# EAGLE schematic EEZ CF-DIC r5B7 (EAGLE 7.2.0)
Assembly variants: Farnell, TME

## Sheet 1 of 3: AC input, Bias supply
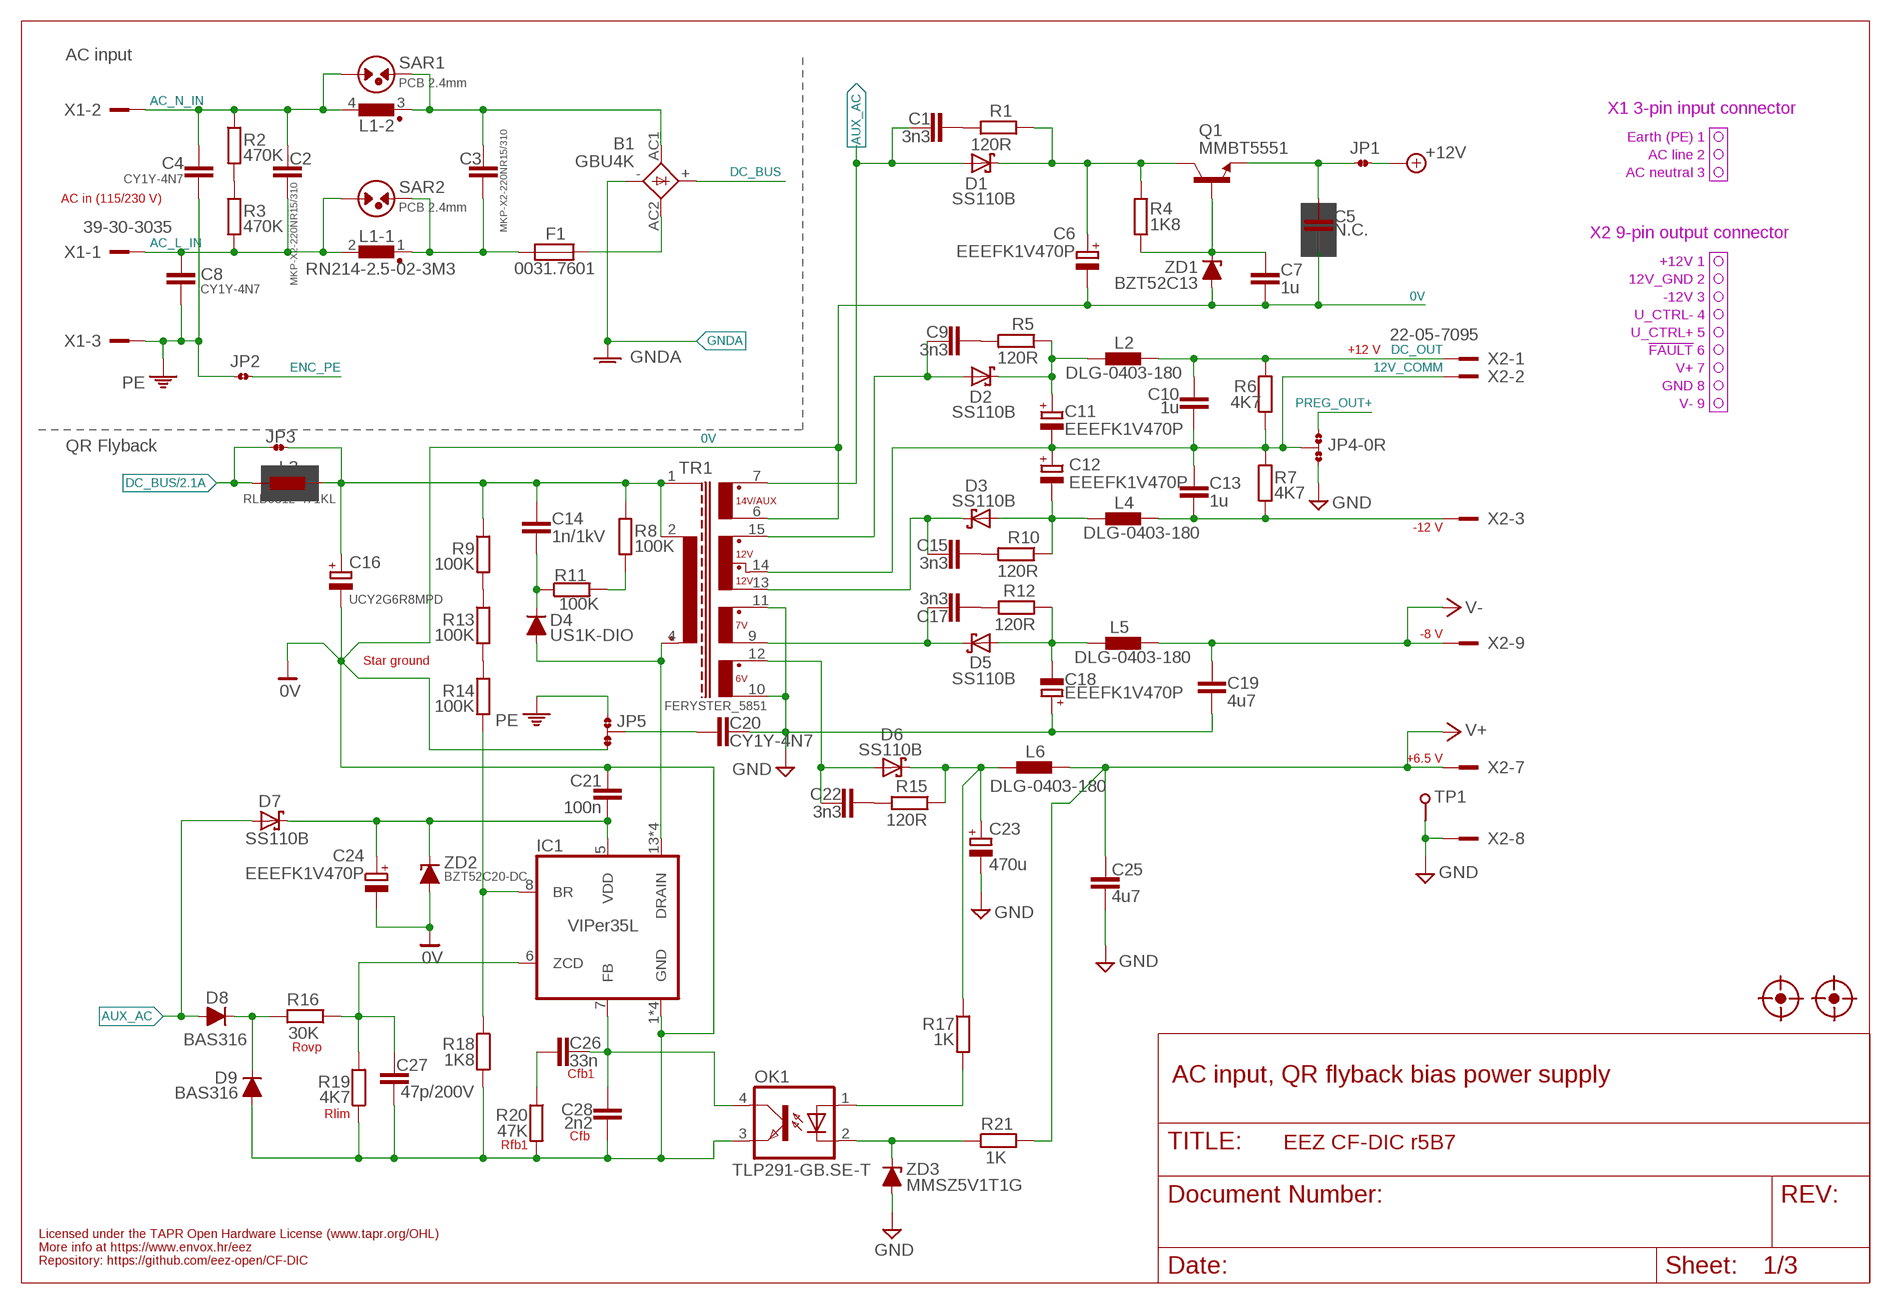
[diagram p0: schematic, sheet 1]

### Parts
B1  GBU4K  BRIDGE-CREEPAGE  [GBU4K_CRE]
C1  3n3  C-EUC0805  [C0805]
C2  MKP-X2-220NR15/310  C-EU150-072X183  [C150-072X183]
C3  MKP-X2-220NR15/310  C-EU150-072X183  [C150-072X183]
C4  CY1Y-4N7  C-EUCY  [CY075-032X103]
C5  N.C.  C-EUC0603  [C0603]
C6  EEEFK1V470P  ECAPPANASONIC_H  [CAPAE660X610N]
C7  1u  C-EUC0805  [C0805]
C8  CY1Y-4N7  C-EUCY  [CY075-032X103]
C9  3n3  C-EUC0805  [C0805]
C10  1u  C-EUC0805  [C0805]
C11  EEEFK1V470P  ECAPPANASONIC_H  [CAPAE660X610N]
C12  EEEFK1V470P  ECAPPANASONIC_H  [CAPAE660X610N]
C13  1u  C-EUC0805  [C0805]
C14  1n/1kV  C-EUC1210  [C1210]
C15  3n3  C-EUC0805  [C0805]
C16  UCY2G6R8MPD  ECAP5G_10.5MM  [ECAP5/10.5]
C17  3n3  C-EUC0805  [C0805]
C18  EEEFK1V470P  ECAPPANASONIC_H  [CAPAE660X610N]
C19  4u7  C-EUC1206  [C1206]
C20  CY1Y-4N7  C-EUCY  [CY075-032X103]
C21  100n  C-EUC0603  [C0603]
C22  3n3  C-EUC0805  [C0805]
C23  470u  ECAP5G_10.5MM  [ECAP5/10.5]
C24  EEEFK1V470P  ECAPPANASONIC_H  [CAPAE660X610N]
C25  4u7  C-EUC1206  [C1206]
C26  33n  C-EUC0805  [C0805]
C27  47p/200V  C-EUC0805  [C0805]
C28  2n2  C-EUC0805  [C0805]
D1  SS110B  SCHOTTKYSMB  [SMB]
D2  SS110B  SCHOTTKYSMB  [SMB]
D3  SS110B  SCHOTTKYSMB  [SMB]
D4  US1K-DIO  DIODEDO214AA  [DO214AA]
D5  SS110B  SCHOTTKYSMB  [SMB]
D6  SS110B  SCHOTTKYSMB  [SMB]
D7  SS110B  SCHOTTKYSMA_DO-214AC  [SMA]
D8  BAS316  DIODESOD323R  [SOD323-R]
D9  BAS316  DIODESOD323R  [SOD323-R]
F1  0031.7601  FUSE_TR5  [FUSE_TR5]
FM1  FIDUCIAL_2  [FIDUCIAL_DUAL]
FM2  FIDUCIAL_2  [FIDUCIAL_DUAL]
IC1  VIPer35L  VIPER35  [SOIC-16]
JP1  JP2-NOCUT  [JP2-NOCUT]
JP2  JP2-CUT  [JP2-CUT]
JP3  JP2-NOCUT  [JP2-NOCUT]
JP4  0R-JUMPA  [A0R-JMP]
JP5  JP3-CUT  [JP3-CUT]
L1  RN214-2.5-02-3M3  RN214  [RN214]
L2  DLG-0403-180  DE0403  [DE0403]
L3  RLB0812-471KL  FERYSTER_DSZ6  [FERSYTER_DSZ6]
L4  DLG-0403-180  DE0403  [DE0403]
L5  DLG-0403-180  DE0403  [DE0403]
L6  DLG-0403-180  DE0403  [DE0403]
OK1  TLP291-GB.SE-T  TLP291  [SO4]
Q1  MMBT5551  MMBT5551LT1-NPN-SOT23-BEC  [SOT23-BEC]
R1  120R  R-EU_R0805  [R0805]
R2  470K  R-EU_R1206  [R1206]
R3  470K  R-EU_R1206  [R1206]
R4  1K8  R-EU_R0805  [R0805]
R5  120R  R-EU_R0805  [R0805]
R6  4K7  R-EU_R0805  [R0805]
R7  4K7  R-EU_R0805  [R0805]
R8  100K  R-EU_R1206  [R1206]
R9  100K  R-EU_R1206  [R1206]
R10  120R  R-EU_R0805  [R0805]
R11  100K  R-EU_R1206  [R1206]
R12  120R  R-EU_R0805  [R0805]
R13  100K  R-EU_R1206  [R1206]
R14  100K  R-EU_R1206  [R1206]
R15  120R  R-EU_R0805  [R0805]
R16  30K  R-EU_R0805  [R0805]
R17  1K  R-EU_R0805  [R0805]
R18  1K8  R-EU_R0805  [R0805]
R19  4K7  R-EU_R0805  [R0805]
R20  47K  R-EU_R0805  [R0805]
R21  1K  R-EU_R0805  [R0805]
SAR1  PCB 2.4mm  SARPCB-2.4MM  [PCB-SAR_2.4MM]
SAR2  PCB 2.4mm  SARPCB-2.4MM  [PCB-SAR_2.4MM]
TP1  PCB_TEST_TABSHIELD  [PCB_SHIELD_TAB]
TR1  FERYSTER_5851  [FERYSTER_5572]
X1  39-30-3035  MINIFIT_6659-3-CRE  [MINIFIT_6659-3_CRE]
X2  22-05-7095  SPOX_22-05-7095  [SPOX_22-05-7095]
ZD1  BZT52C13  ZENER-DIODESOD123  [SOD123]
ZD2  BZT52C20-DC  ZENER-DIODESOD123  [SOD123]
ZD3  MMSZ5V1T1G  ZENER-DIODESOD123  [SOD123]

### Nets
0V: C5.2 C6.2(-) C7.2 C16.- C21.1 C24.2(-) C27.2 C28.2 D9.A IC1.1(GND) IC1.2(GND) IC1.3(GND) IC1.4(GND) JP5.NC OK1.3(EMIT) R18.2 R19.1 R20.2 TR1.6(S_AUX) ZD1.A ZD2.A ; also sheet 2
6VAC: C22.2 D6.A TR1.12(6V_DOT)
7VAC: C17.2 D5.C TR1.9(7V)
12V_COMM: C10.2 C11.2(-) C12.1(+) C13.1 JP4.2 R6.2 R7.1 TR1.14(12V_DOT) X2.2
12VAC1: C9.2 D2.A TR1.15(12V_DOT2)
12VAC2: C15.2 D3.C TR1.13(12V)
+6V_REC: C23.+ D6.C L6.1 R15.1 R17.1
+12V: JP1.2 ; also sheet 2
+12V_REC: C11.1(+) D2.C L2.1 R5.1
-7V_REC: C18.2(-) D5.A L5.1 R12.1
-12V: C13.2 L4.2 R7.2 X2.3
-12V_REC: C12.2(-) D3.A L4.1 R10.1
AC_L_IN: C2.2 C8.2 L1.2 R3.2 SAR2.1 X1.1
AC_N_IN: C2.1 C4.2 L1.4 R2.1 SAR1.1 X1.2
AUX_AC: C1.2 D1.A D7.A D8.A TR1.7(S_AUX_DOT)
AUX_REC: C6.1(+) D1.C Q1.C R1.1 R4.1
DC_BUS: B1.+ JP3.1 L3.P$1 ; also sheet 2
DC_OUT: C10.1 L2.2 R6.1 X2.1
ENC_PE: JP2.2
FB2: OK1.2(C) R21.1 ZD3.C
GND: C18.1(+) C19.1 C20.2 C23.- C25.2 JP4.3 TP1.1 TR1.10(6V) TR1.11(7V_DOT) X2.8 ZD3.A ; also sheet 2,3
GNDA: B1.- ; also sheet 2
N$4: C20.1 JP5.COM
N$20: IC1.8(BR) R14.2 R18.1
N$24: C5.1 JP1.1 Q1.E
N$27: C21.2 C24.1(+) D7.C IC1.5(VDD) ZD2.C
N$33: R2.2 R3.1
N$41: B1.AC1 C3.1 L1.3 SAR1.2
N$43: C3.2 F1.1 L1.1 SAR2.2
N$49: R13.2 R14.1
N$60: R9.2 R13.1
N$61: B1.AC2 F1.2
N$65: C15.1 R10.2
N$78: R8.2 R11.2
N$133: C7.1 Q1.B R4.2 ZD1.C
N$135: OK1.1(A) R17.2
N$137: C14.2 D4.C R11.1
N$138: C26.2 C28.1 IC1.7(FB) OK1.4(COL)
N$139: C9.1 R5.2
N$140: C1.1 R1.2
N$141: C27.1 IC1.6(ZCD) R16.1 R19.2
N$144: C17.1 R12.2
N$146: C22.1 R15.2
N$152: C26.1 R20.1
N$155: D8.C D9.C R16.2
PE: C4.1 C8.1 JP2.1 JP5.NO X1.3 ; also sheet 3
PREG_OUT+: JP4.1 ; also sheet 3
V+: C25.1 L6.2 R21.2 X2.7 ; also sheet 3
V-: C19.2 L5.2 X2.9 ; also sheet 3
VIPER+: C14.1 C16.+ JP3.2 L3.P$2 R8.1 R9.1 TR1.1(SHIELD) TR1.2(P)
VIPER_D: D4.A IC1.13(DRAIN) IC1.14(DRAIN) IC1.15(DRAIN) IC1.16(DRAIN) TR1.4(P2_DOT)

### Notes on the sheet
- AC input
- X1 3-pin input connector
- Earth (PE) 1
- AC line 2
- AC neutral 3
- AC in (115/230 V)
- X2 9-pin output connector
- +12V 1
- 12V_GND 2
- -12V 3
- U_CTRL- 4
- U_CTRL+ 5
- !FAULT! 6
- +12 V
- V+ 7
- GND 8
- V- 9
- QR Flyback
- -12 V
- -8 V
- Star ground
- +6.5 V
- Rovp
- Cfb1
- AC input, QR flyback bias power supply
- Rlim
- Cfb
- Rfb1
- Licensed under the TAPR Open Hardware License (www.tapr.org/OHL)
- More info at https://www.envox.hr/eez
- Repository: https://github.com/eez-open/CF-DIC

## Sheet 2 of 3: HV buck, DIC
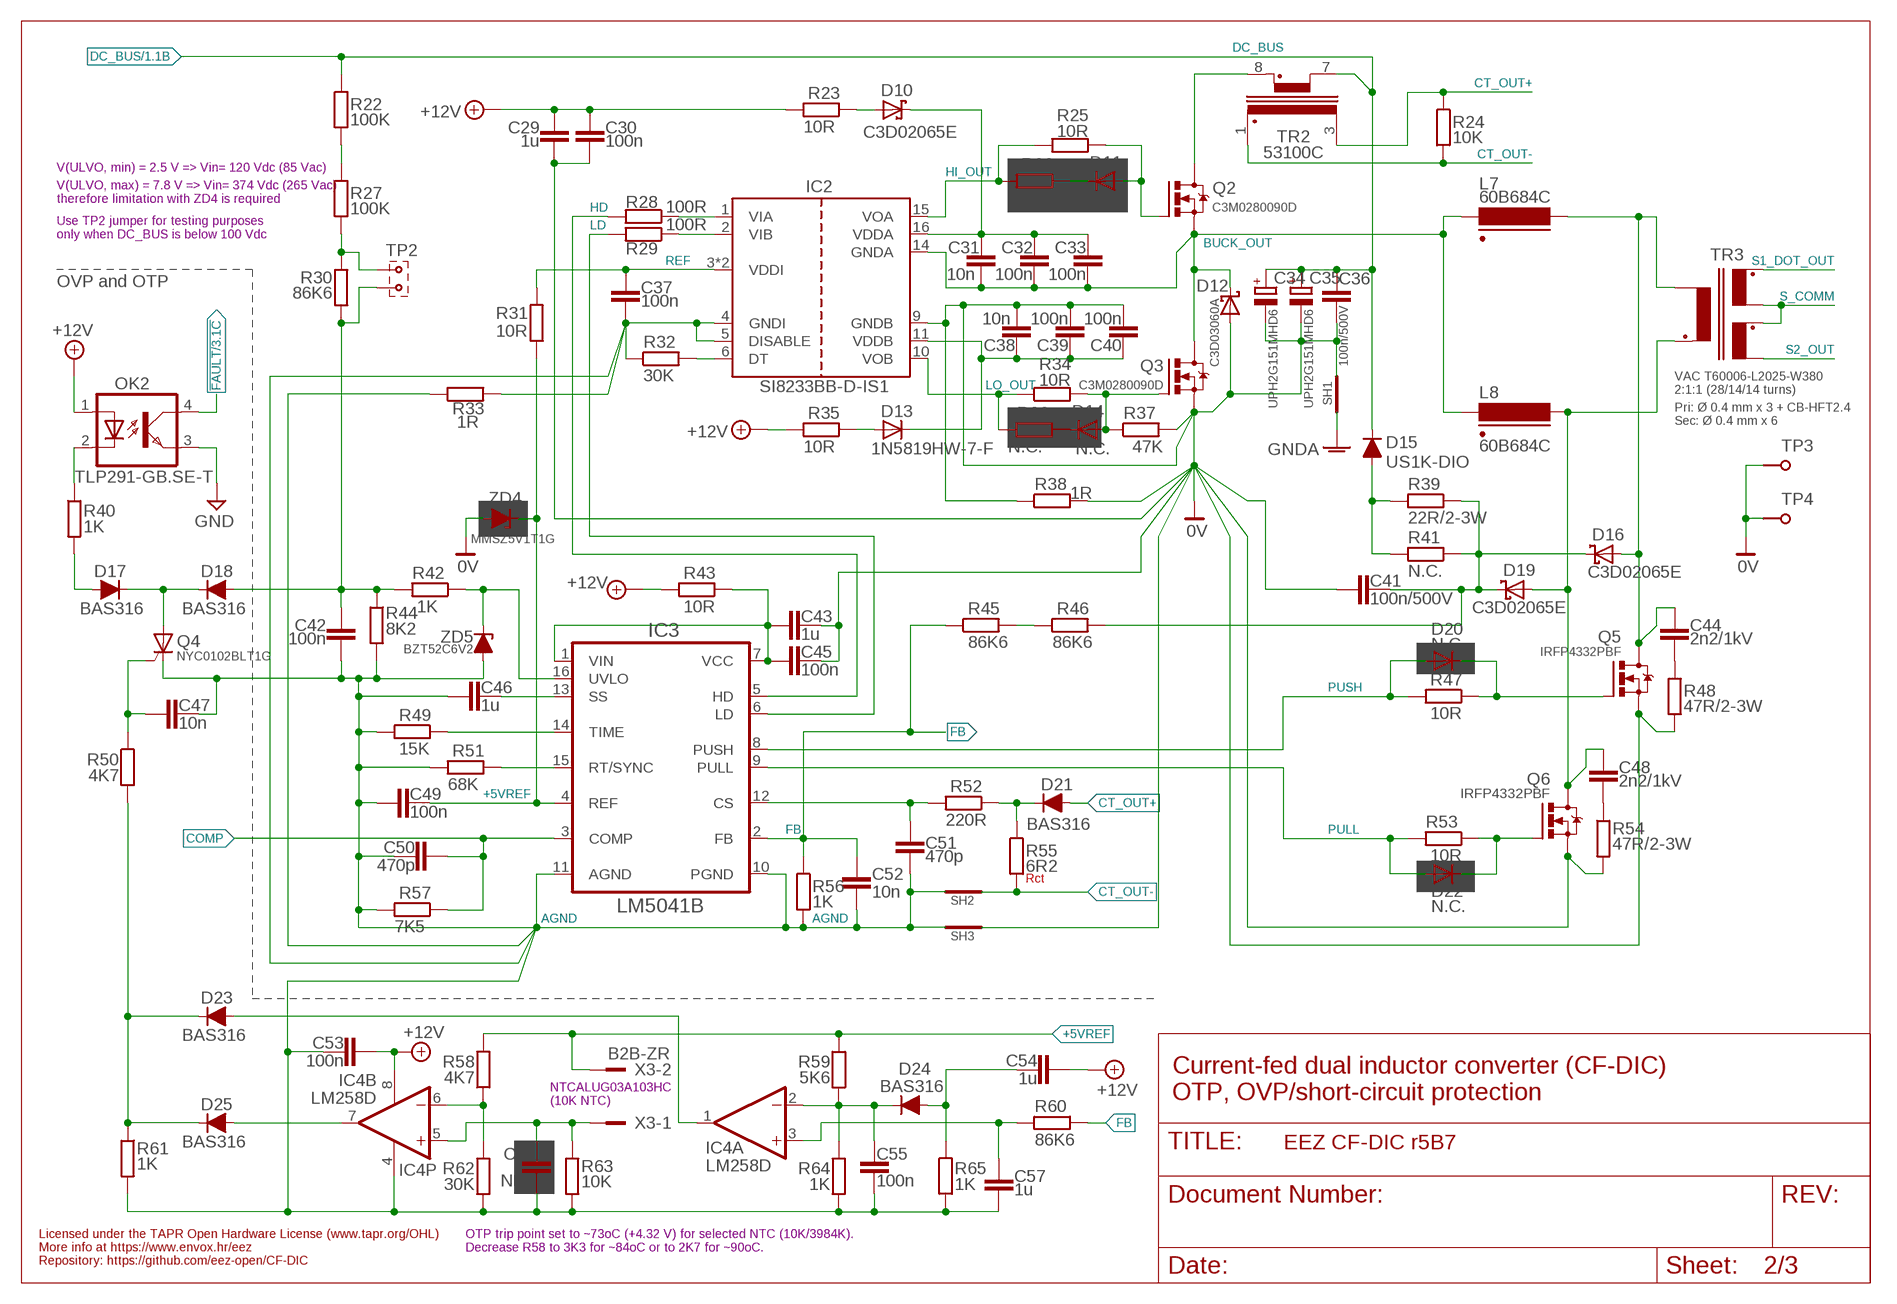
[diagram p1: schematic, sheet 2]

### Parts
C29  1u  C-EUC0805  [C0805]
C30  100n  C-EUC0603  [C0603]
C31  10n  C-EUC0603  [C0603]
C32  100n  C-EUC0603  [C0603]
C33  100n  C-EUC0603  [C0603]
C34  UPH2G151MHD6  ECAP7.5G_18MM  [ECAP7.5/18]
C35  UPH2G151MHD6  ECAP7.5G_18MM  [ECAP7.5/18]
C36  100n/500V  C-EUC1812  [C1812]
C37  100n  C-EUC0603  [C0603]
C38  10n  C-EUC0603  [C0603]
C39  100n  C-EUC0603  [C0603]
C40  100n  C-EUC0603  [C0603]
C41  100n/500V  C-EUC1812  [C1812]
C42  100n  C-EUC0603  [C0603]
C43  1u  C-EUC0805  [C0805]
C44  2n2/1kV  C-EUC1210  [C1210]
C45  100n  C-EUC0603  [C0603]
C46  1u  C-EUC0805  [C0805]
C47  10n  C-EUC0603  [C0603]
C48  2n2/1kV  C-EUC1210  [C1210]
C49  100n  C-EUC0603  [C0603]
C50  470p  C-EUC0805  [C0805]
C51  470p  C-EUC0805  [C0805]
C52  10n  C-EUC0603  [C0603]
C53  100n  C-EUC0603  [C0603]
C54  1u  C-EUC0805  [C0805]
C55  100n  C-EUC0603  [C0603]
C56  N.C.  C-EUC0603  [C0603]
C57  1u  C-EUC0805  [C0805]
D10  C3D02065E  SCHOTTKY-SIC_L  [TO252-L]
D11  N.C.  DIODE-SOD323-W  [SOD323-W]
D12  C3D03060A  SCHOTTKY-TO220  [TO220-2]
D13  1N5819HW-7-F  DIODE-SOD323-W  [SOD323-W]
D14  N.C.  DIODE-SOD323-W  [SOD323-W]
D15  US1K-DIO  DIODEDO214AA  [DO214AA]
D16  C3D02065E  SCHOTTKY-SIC_L  [TO252-L]
D17  BAS316  DIODESOD323R  [SOD323-R]
D18  BAS316  DIODESOD323R  [SOD323-R]
D19  C3D02065E  SCHOTTKY-SIC_L  [TO252-L]
D20  N.C.  DIODE-SOD323-W  [SOD323-W]
D21  BAS316  DIODESOD323R  [SOD323-R]
D22  N.C.  DIODE-SOD323-W  [SOD323-W]
D23  BAS316  DIODESOD323R  [SOD323-R]
D24  BAS316  DIODESOD323R  [SOD323-R]
D25  BAS316  DIODESOD323R  [SOD323-R]
IC2  SI8233BB-D-IS1  SI8233  [SOIC-16]
IC3  LM5041B  LM5041  [MTC16]
IC4  LM258D  TL072SOIC8  [SOIC127P600X173-8N]
L7  60B684C  MURATA_6000B  [MURATA_6000B]
L8  60B684C  MURATA_6000B  [MURATA_6000B]
OK2  TLP291-GB.SE-T  TLP291  [SO4]
Q2  C3M0280090D  IRFP240  [TO247BV]
Q3  C3M0280090D  IRFP240  [TO247BV]
Q4  NYC0102BLT1G  [SOT23]
Q5  IRFP4332PBF  IRFP240  [TO247BV]
Q6  IRFP4332PBF  IRFP240  [TO247BV]
R22  100K  R-EU_R1206  [R1206]
R23  10R  R-EU_R0805  [R0805]
R24  10K  R-EU_R0805  [R0805]
R25  10R  R-EU_R0805  [R0805]
R26  N.C.  R-EU_R0805  [R0805]
R27  100K  R-EU_R1206  [R1206]
R28  100R  R-EU_R0805  [R0805]
R29  100R  R-EU_R0805  [R0805]
R30  86K6  R-EU_R0805  [R0805]
R31  10R  R-EU_R0805  [R0805]
R32  30K  R-EU_R0805  [R0805]
R33  1R  R-EU_R0805  [R0805]
R34  10R  R-EU_R0805  [R0805]
R35  10R  R-EU_R0805  [R0805]
R36  N.C.  R-EU_R0805  [R0805]
R37  47K  R-EU_R0805  [R0805]
R38  1R  R-EU_R0805  [R0805]
R39  22R/2-3W  R-EU_R2512  [R2512]
R40  1K  R-EU_R0805  [R0805]
R41  N.C.  R-EU_R2512  [R2512]
R42  1K  R-EU_R0805  [R0805]
R43  10R  R-EU_R0805  [R0805]
R44  8K2  R-EU_R0805  [R0805]
R45  86K6  R-EU_R0805  [R0805]
R46  86K6  R-EU_R0805  [R0805]
R47  10R  R-EU_R0805  [R0805]
R48  47R/2-3W  R-EU_R2512  [R2512]
R49  15K  R-EU_R0805  [R0805]
R50  4K7  R-EU_R0805  [R0805]
R51  68K  R-EU_R0805  [R0805]
R52  220R  R-EU_R0805  [R0805]
R53  10R  R-EU_R0805  [R0805]
R54  47R/2-3W  R-EU_R2512  [R2512]
R55  6R2  R-EU_R0805  [R0805]
R56  1K  R-EU_R0805  [R0805]
R57  7K5  R-EU_R0805  [R0805]
R58  4K7  R-EU_R0805  [R0805]
R59  5K6  R-EU_R0805  [R0805]
R60  86K6  R-EU_R0805  [R0805]
R61  1K  R-EU_R0805  [R0805]
R62  30K  R-EU_R0805  [R0805]
R63  10K  R-EU_R0805  [R0805]
R64  1K  R-EU_R0805  [R0805]
R65  1K  R-EU_R0805  [R0805]
SH1  SHORTNOHOLE  [SHORT_NOHOLE]
SH2  SHORTNOHOLE  [SHORT_NOHOLE]
SH3  SHORTNOHOLE  [SHORT_NOHOLE]
TP2  JUMPER-2PIN-2MM  [2MM-2]
TP3  TEST-PIN1.2  [TEST-PIN_1.2MM]
TP4  TEST-PIN1.2  [TEST-PIN_1.2MM]
TR2  53100C  MURATA_5300  [MURATA_5300]
TR3  VAC T60006-L2025-W380  PCB_TRAFO_FLYBACK2-VAC  [VAC_DUAL_SEC]
X3  B2B-ZR  [B2B-ZR]
ZD4  MMSZ5V1T1G  ZENER-DIODESOD123  [SOD123]
ZD5  BZT52C6V2  ZENER-DIODESOD123  [SOD123]

### Nets
0V: C29.1 C30.1 C34.- C35.- C36.2 C38.2 C39.2 C40.2 C41.1 C43.2 C45.2 D12.2(A) IC2.9(GNDB) Q3.S Q5.S Q6.S R37.2 R38.1 R38.2 R48.2 R54.2 SH1.P$2(GND_B) SH3.P$1(GND_A) TP3.1 TP4.1 ZD4.A ; also sheet 1
!FAULT: OK2.4(COL) ; also sheet 3
+5VREF: C49.2 IC3.4(REF) R31.1 R58.2 R59.2 X3.2 ZD4.C
+12V: C29.2 C30.2 C53.1 C54.1 IC4.8(P:V+) OK2.1(A) R23.2 R35.2 R43.2 ; also sheet 1
AGND: C37.1 C42.2 C46.1 C47.2 C49.1 C50.1 C51.1 C52.2 C53.2 C55.2 C56.1 C57.1 IC2.4(GNDI) IC2.5(DISABLE) IC3.10(PGND) IC3.11(AGND) IC4.4(P:V-) Q4.1(C) R32.1 R33.1 R33.2 R44.2 R49.2 R51.2 R56.2 R57.2 R61.2 R62.2 R63.2 R64.2 R65.2 SH2.P$2(GND_B) SH3.P$2(GND_B) ZD5.A ; also sheet 3
BUCK_OUT: C31.2 C32.2 C33.2 D12.1(C) IC2.14(GNDA) L7.2 L8.2 Q2.S Q3.D
CLAMP_C: C41.2 D16.1(C) D16.3(C) D19.1(C) D19.3(C) R39.1 R41.1 R46.2
COMP: C50.2 IC3.3(COMP) R57.1 ; also sheet 3
CT_OUT+: D21.A R24.1 TR2.3(S)
CT_OUT-: R24.2 R55.2 SH2.P$1(GND_A) TR2.1(S_DOT)
DC_BUS: C34.+ C35.+ C36.1 D15.C R22.1 TR2.7(P) ; also sheet 1
FB: C52.1 IC3.2(FB) R45.1 R56.1 R60.1
GND: OK2.3(EMIT) ; also sheet 1,3
GNDA: SH1.P$1(GND_A) ; also sheet 1
HD: IC3.5(HD) R28.2
HI_OUT: IC2.15(VOA) R25.2 R26.2
L_PULL: C48.2 D19.2(A) L8.1 Q6.D TR3.P1_DOT(P_DOT)
L_PUSH: C44.2 D16.2(A) L7.1 Q5.D TR3.P1(P)
LD: IC3.6(LD) R29.2
LO_OUT: IC2.10(VOB) R34.1 R36.1
N$2: R27.2 R30.1 TP2.1
N$3: C31.1 C32.1 C33.1 D10.1(C) D10.3(C) IC2.16(VDDA)
N$5: C48.1 R54.1
N$6: R22.2 R27.1
N$7: C55.1 D24.C IC4.2(A:-IN) R59.1 R64.1
N$13: D20.C Q5.G R47.1
N$14: D22.C Q6.G R53.1
N$15: Q2.D TR2.8(P_DOT)
N$19: IC3.15(RT/SYNC) R51.1
N$21: D11.A Q2.G R25.1
N$22: IC3.14(TIME) R49.1
N$23: C46.2 IC3.13(SS)
N$25: IC3.16(UVLO) R42.1 ZD5.C
N$26: IC4.6(B:-IN) R58.1 R62.1
N$29: D14.A Q3.G R34.2 R37.1
N$30: R45.2 R46.1
N$31: D10.2(A) R23.1
N$32: OK2.2(C) R40.1
N$34: C57.2 IC4.3(A:+IN) R60.2
N$35: D15.A R39.2 R41.2
N$36: IC2.1(VIA) R28.1
N$37: C51.2 IC3.12(CS) R52.2
N$38: D23.A IC4.1(A:OUT)
N$40: IC2.2(VIB) R29.1
N$42: C56.2 IC4.5(B:+IN) R63.1 X3.1
N$45: D11.C R26.1
N$47: D25.A IC4.7(B:OUT)
N$48: IC2.6(DT) R32.2
N$51: D23.C D25.C R50.2 R61.1
N$52: D14.C R36.2
N$54: C43.1 C45.1 IC3.1(VIN) IC3.7(VCC) R43.1
N$55: C38.1 C39.1 C40.1 D13.C IC2.11(VDDB)
N$56: D21.C R52.1 R55.1
N$59: C54.2 D24.A R65.1
N$63: D13.A R35.1
N$68: C44.1 R48.1
N$100: C47.1 Q4.2(G) R50.1
N$126: D17.C D18.C Q4.3(A)
N$130: D17.A R40.2
PULL: D22.A IC3.9(PULL) R53.2
PUSH: D20.A IC3.8(PUSH) R47.2
REF: C37.2 IC2.3(VDDI) IC2.8(VDDI) R31.2
S1_DOT_OUT: TR3.S1_DOT ; also sheet 3
S2_OUT: TR3.S2 ; also sheet 3
S_COMM: TR3.S1 TR3.S2_DOT ; also sheet 3
UVLO: C42.1 D18.A R30.2 R42.2 R44.1 TP2.2

### Notes on the sheet
- V(ULVO, min) = 2.5 V => Vin= 120 Vdc (85 Vac)
- V(ULVO, max) = 7.8 V => Vin= 374 Vdc (265 Vac)
  therefore limitation with ZD4 is required
- Use TP2 jumper for testing purposes
  only when DC_BUS is below 100 Vdc
- OVP and OTP
- 2:1:1 (28/14/14 turns)
- Pri: Ø 0.4 mm x 3 + CB-HFT2.4
- Sec: Ø 0.4 mm x 6
- Rct
- Current-fed dual inductor converter (CF-DIC)
  OTP, OVP/short-circuit protection
- NTCALUG03A103HC
  (10K NTC)
- OTP trip point set to ~73oC (+4.32 V) for selected NTC (10K/3984K).
  Decrease R58 to 3K3 for ~84oC or to 2K7 for ~90oC.
- Licensed under the TAPR Open Hardware License (www.tapr.org/OHL)
- More info at https://www.envox.hr/eez
- Repository: https://github.com/eez-open/CF-DIC

## Sheet 3 of 3: Sync. rec, NFB+tracker
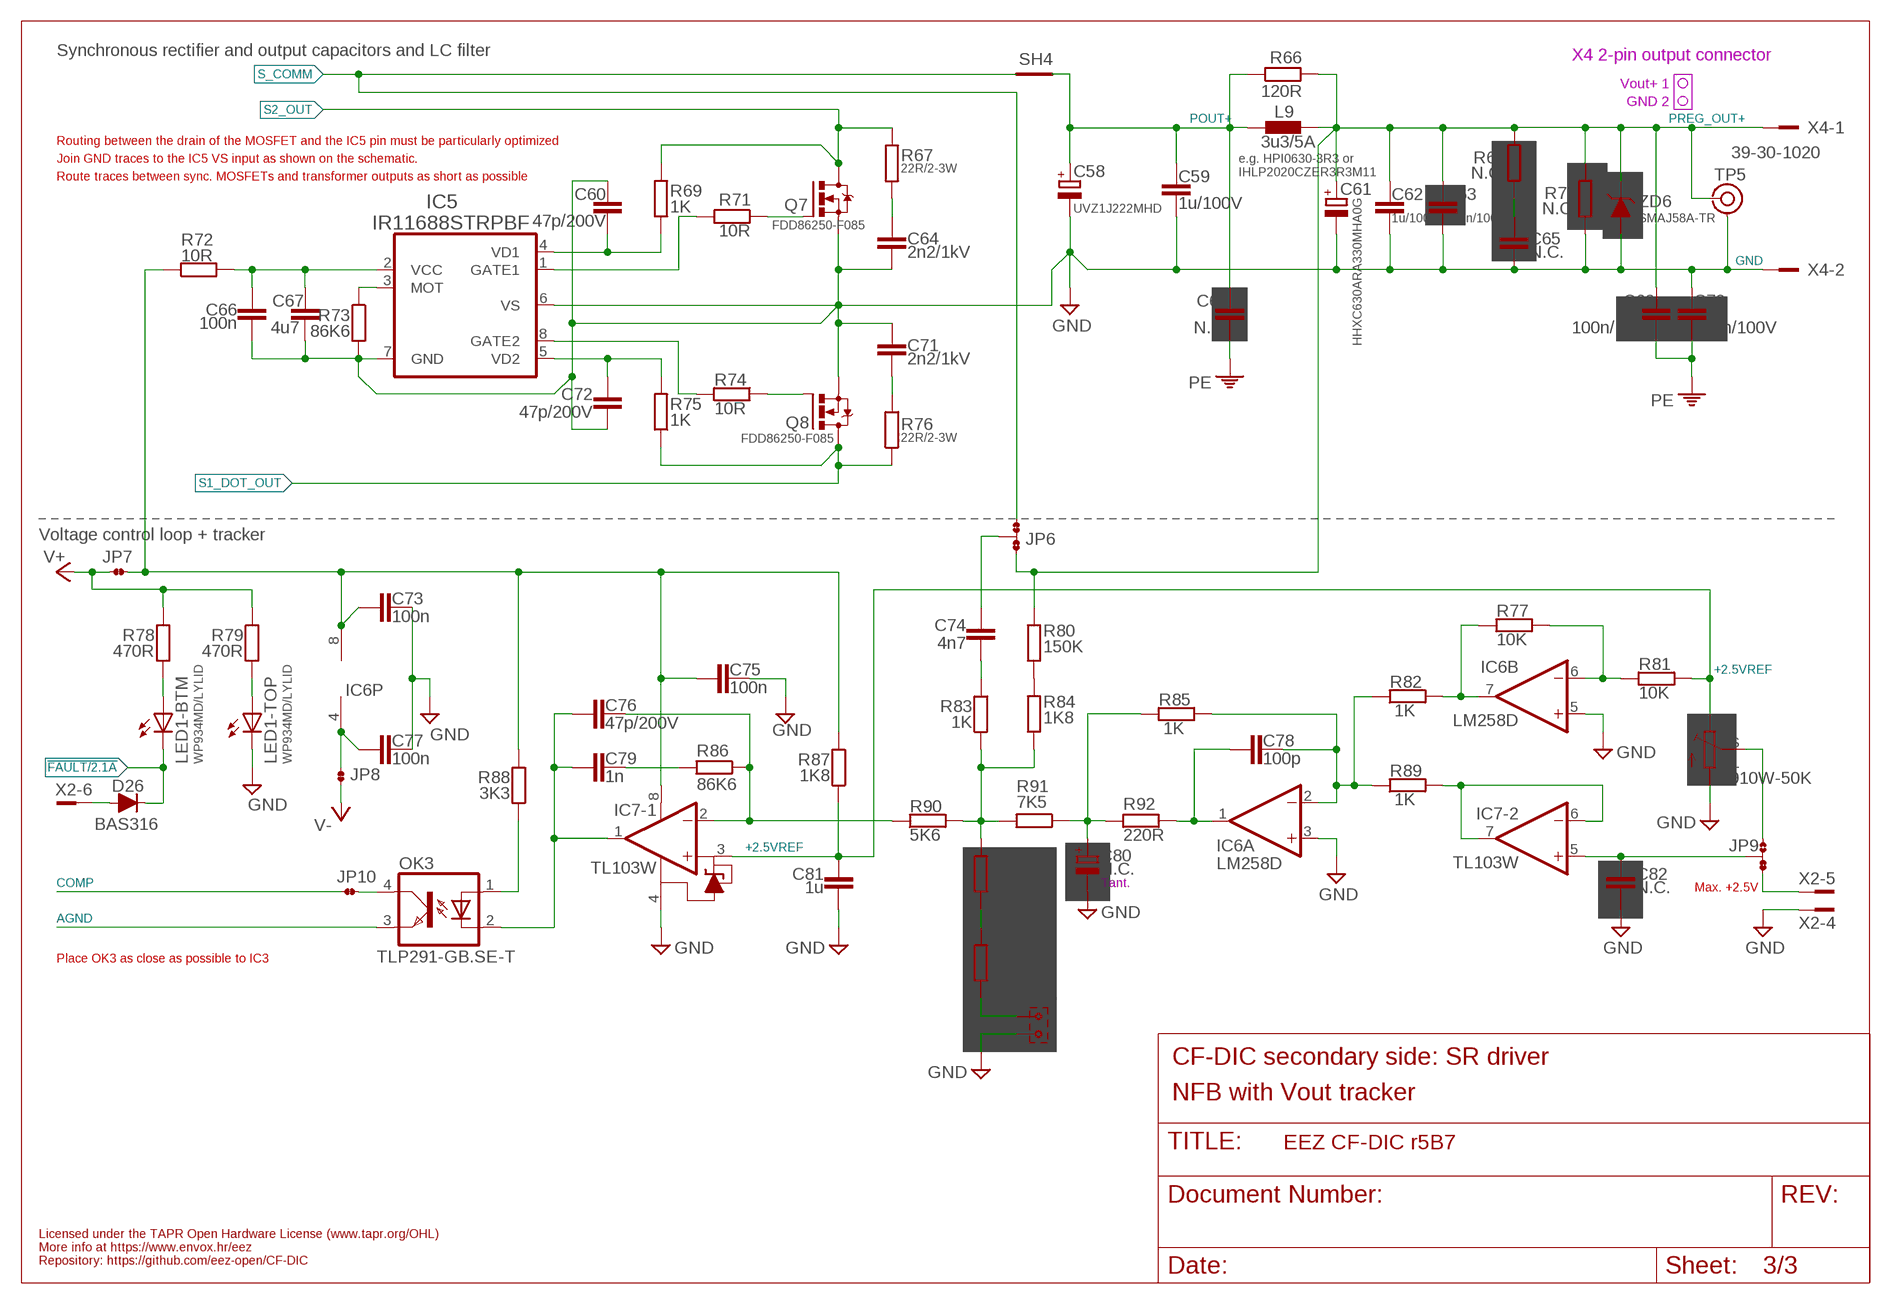
[diagram p2: schematic, sheet 3]

### Parts
C58  UVZ1J222MHD  ECAPH35.5A  [ECAP7.5/18-H35.5A]
C59  1u/100V  C-EUC1206  [C1206]
C60  47p/200V  C-EUC0805  [C0805]
C61  HHXC630ARA330MHA0G  ECAPSMD8.3MM/HA0  [CAPAE830X1050N]
C62  1u/100V  C-EUC1206  [C1206]
C63  100n/100V  C-EUC1206  [C1206]
C64  2n2/1kV  C-EUC1210  [C1210]
C65  N.C.  C-EUC1206  [C1206]
C66  100n  C-EUC0603  [C0603]
C67  4u7  C-EUC1206  [C1206]
C68  N.C.  C-EUC1206  [C1206]
C69  100n/100V  C-EUC1206  [C1206]
C70  100n/100V  C-EUC1206  [C1206]
C71  2n2/1kV  C-EUC1210  [C1210]
C72  47p/200V  C-EUC0805  [C0805]
C73  100n  C-EUC0603  [C0603]
C74  4n7  C-EUC0805  [C0805]
C75  100n  C-EUC0603  [C0603]
C76  47p/200V  C-EUC0805  [C0805]
C77  100n  C-EUC0603  [C0603]
C78  100p  C-EUC0805  [C0805]
C79  1n  C-EUC0805  [C0805]
C80  N.C.  ECAP1206  [EC1206]
C81  1u  C-EUC0805  [C0805]
C82  N.C.  C-EUC0805  [C0805]
D26  BAS316  DIODESOD323R  [SOD323-R]
IC5  IR11688STRPBF  IR11688  [SO8]
IC6  LM258D  TL072SOIC8  [SOIC127P600X173-8N]
IC7  TL103W  [SOIC127P600X173-8N]
JP6  JP3-CUT  [JP3-CUT]
JP7  JP2-NOCUT  [JP2-NOCUT]
JP8  JP2-NOCUT  [JP2-NOCUT]
JP9  JP3-CUT  [JP3-CUT]
JP10  JP2-NOCUT  [JP2-NOCUT]
L9  3u3/5A  COILCRAFT_HPI0630  [COILCRAFT_HPI0630]
LED1  WP934MD/LYLID  [WP934MD]
OK3  TLP291-GB.SE-T  TLP291  [SO4]
P1  T910W-50K  TPOT-S64W  [S64W]
Q7  FDD86250-F085  N-MOSFETDPAK  [TO229P990X239-3N]
Q8  FDD86250-F085  N-MOSFETDPAK  [TO229P990X239-3N]
R66  120R  R-EU_R0805  [R0805]
R67  22R/2-3W  R-EU_R2512  [R2512]
R68  N.C.  R-EU_R1210  [R1210]
R69  1K  R-EU_R0805  [R0805]
R70  N.C.  R-EU_R2512  [R2512]
R71  10R  R-EU_R0805  [R0805]
R72  10R  R-EU_R0805  [R0805]
R73  86K6  R-EU_R0805  [R0805]
R74  10R  R-EU_R0805  [R0805]
R75  1K  R-EU_R0805  [R0805]
R76  22R/2-3W  R-EU_R2512  [R2512]
R77  10K  R-EU_R0805  [R0805]
R78  470R  R-EU_R0805  [R0805]
R79  470R  R-EU_R0805  [R0805]
R80  150K  R-EU_R0805  [R0805]
R81  10K  R-EU_R0805  [R0805]
R82  1K  R-EU_R0805  [R0805]
R83  1K  R-EU_R0805  [R0805]
R84  1K8  R-EU_R0805  [R0805]
R85  1K  R-EU_R0805  [R0805]
R86  86K6  R-EU_R0805  [R0805]
R87  1K8  R-EU_R0805  [R0805]
R88  3K3  R-EU_R0805  [R0805]
R89  1K  R-EU_R0805  [R0805]
R90  5K6  R-EU_R0805  [R0805]
R91  7K5  R-EU_R0805  [R0805]
R92  220R  R-EU_R0805  [R0805]
R93  N.C.  R-EU_R0805  [R0805]
R94  N.C.  R-EU_R0805  [R0805]
SH4  SHORTNOHOLE  [SHORT_NOHOLE]
TP5  TEST_POINT-2  [TP_1.1MM_2]
TP6  JUMPER-2PIN-2MM  [2MM-2]
X4  39-30-1020  MINIFIT_39301020  [MINIFIT_39301020]
ZD6  SMAJ58A-TR  PSMAXX  [DO214AC]

### Nets
!FAULT: D26.C LED1.BC(-BTM:C) ; also sheet 2
+2.5VREF: C81.1 IC7.3(-1:+IN1) P1.E R81.2 R87.1
AGND: OK3.3(EMIT) ; also sheet 2
COMP: JP10.1 ; also sheet 2
G1_OUT: Q7.1(G) R71.1
G2_OUT: Q8.1(G) R74.1
GATE1: IC5.1(GATE1) R71.2
GATE2: IC5.8(GATE2) R74.2
GND: C58.- C59.2 C60.1 C61.- C62.2 C63.2 C64.2 C65.1 C66.2 C67.2 C70.1 C71.2 C72.1 C73.2 C75.2 C77.2 C80.- C81.2 C82.2 IC5.6(VS) IC5.7(GND) IC6.3(A:+IN) IC6.5(B:+IN) IC7.4(-1:VCC-) LED1.TC(-TOP:C) P1.A Q7.3(S) Q8.3(S) R70.1 R73.2 TP5.GND TP6.2 X2.4 X4.2 ZD6.A ; also sheet 1,2
N$1: D26.A X2.6
N$8: C65.2 R68.1
N$9: C79.2 R86.2
N$10: C76.2 IC7.2(-1:-IN1) R86.1 R90.1
N$11: LED1.TA(-TOP:A) R79.2
N$12: R80.1 R84.2
N$16: LED1.BA(-BTM:A) R78.2
N$18: IC5.3(MOT) R73.1
N$28: C74.2 R83.2
N$39: C77.1 IC6.4(P:V-) JP8.1
N$44: JP10.2 OK3.4(COL)
N$46: C73.1 C75.1 IC6.8(P:V+) IC7.8(-1:VCC+) JP7.2 R72.1 R87.2 R88.2
N$50: R83.1 R84.1 R90.2 R91.2 R93.2
N$53: IC6.7(B:OUT) R77.1 R82.2
N$57: C82.1 IC7.5(-2:+IN) JP9.COM
N$58: JP9.NO P1.S
N$64: C78.2 IC6.2(A:-IN) R82.1 R85.2 R89.1
N$66: C71.1 R76.2
N$67: C64.1 R67.2
N$71: C74.1 JP6.COM
N$73: R93.1 R94.2
N$76: C76.1 C79.1 IC7.1(-1:OUT1) OK3.2(C)
N$77: R94.1 TP6.1
N$132: IC6.6(B:-IN) R77.2 R81.1
N$134: C78.1 IC6.1(A:OUT) R92.2
NFB_OFFSET: C80.+ R85.1 R91.1 R92.1
OK_A: OK3.1(A) R88.1
PE: C68.2 C69.2 C70.2 ; also sheet 1
POUT+: C58.+ C59.1 C68.1 L9.1 R66.1 SH4.P$2(GND_B)
PREG_OUT+: C61.+ C62.1 C63.1 C69.1 JP6.NO L9.2 R66.2 R68.2 R70.2 R80.2 TP5.TIP X4.1 ZD6.C ; also sheet 1
S1_DOT_OUT: Q8.2(D) R75.1 R76.1 ; also sheet 2
S2_OUT: Q7.2(D) R67.1 R69.2 ; also sheet 2
S_COMM: JP6.NC SH4.P$1(GND_A) ; also sheet 2
SYNC_VCC: C66.1 C67.1 IC5.2(VCC) R72.2
U_CTRL: JP9.NC X2.5
U_MON1: IC7.6(-2:-IN) IC7.7(-2:OUT) R89.2
V+: JP7.1 R78.1 R79.1 ; also sheet 1
V-: JP8.2 ; also sheet 1
VD1: C60.2 IC5.4(VD1) R69.1
VD2: C72.2 IC5.5(VD2) R75.2

### Notes on the sheet
- Synchronous rectifier and output capacitors and LC filter | X4 2-pin output connector
- Vout+ 1
- GND 2
- Routing between the drain of the MOSFET and the IC5 pin must be particularly optimized
- Join GND traces to the IC5 VS input as shown on the schematic.
- e.g. HPI0630-3R3 or
  IHLP2020CZER3R3M11
- Route traces between sync. MOSFETs and transformer outputs as short as possible
- Voltage control loop + tracker
- Max. +2.5V
- Tant.
- Place OK3 as close as possible to IC3
- CF-DIC secondary side: SR driver
- NFB with Vout tracker
- Licensed under the TAPR Open Hardware License (www.tapr.org/OHL)
- More info at https://www.envox.hr/eez
- Repository: https://github.com/eez-open/CF-DIC

## Library data of the parts
B1 = EEZ_Lib1:BRIDGE
C1-C3 C5 C7 C9 C10 C13-C15 C17 C19 C21 C22 C25-C33 C36-C57 C59 C60 C62-C79 C81 C82 = rcl:C-EU: CAPACITOR, European symbol
C4 C8 C20 = EEZ_Lib1:C-EU
C6 C11 C12 C16 C18 C23 C24 C34 C35 C58 C61 C80 = EEZ_Lib1:ECAP
D1-D3 D5-D7 D10 D12 D16 D19 = EEZ_Lib1:SCHOTTKY
D4 D8 D9 D15 D17 D18 D21 D23-D26 = EEZ_Lib1:DIODE
D11 D13 D14 D20 D22 = diode:DIODE-: DIODE
F1 = EEZ_Lib1:FUSE_TR5: Subminiature fuse holder for TR5; ∅9.5 mm
FM1 FM2 = EEZ_Lib1:FIDUCIAL: Fiducial mark for pick and place automation
IC1 = EEZ_Lib1:VIPER35: Quasi-resonant high performance off line high voltage converter, 800 V
IC2 = EEZ_Lib1:SI8233: Dual 4.0 Amp ISOdrivers with deadtime control and overlap protection
IC3 = EEZ_Lib1:LM5041: Cascaded PWM Controller; MANUFACTURER_PART_NUMBER: lm5041mtcnopb; VENDOR: TI
IC4 IC6 = EEZ_Lib1:TL072
IC5 = EEZ_Lib1:IR11688: Dual smart rectifier driver IC with programmable MOT
IC7 = EEZ_Lib1:TL103W: Dual Operational Amplifiers With Internal Reference
JP1 JP3 JP7 JP8 JP10 = EEZ_Lib1:JP2-NOCUT
JP2 = EEZ_Lib1:JP2-CUT
JP4 = jump-0r-smd:0R-JUMP: SMD 0R 0805 Jumper
JP5 JP6 JP9 = EEZ_Lib1:JP3-CUT
L1 = EEZ_inductors_and_transformers:RN214: Schaffner EMC/EMI current-compensated chokes, vertical case; FARNELL: 1191518
L2 L4-L6 = EEZ_inductors_and_transformers:DE0403: Ferrocore SMD power coil 4.0 x 4.5 mm
L3 = EEZ_Lib1:FERYSTER_DSZ6: Feryster DSZ type choke on RSZ ferrite core
L7 L8 = EEZ_inductors_and_transformers:MURATA_6000B: Surface Mount Power Inductors (47μH to 680μH)
L9 = EEZ_inductors_and_transformers:COILCRAFT_HPI0630: High power inductor
LED1 = EEZ_Lib1:WP934MD: Kingbright LED; in housing; 3mm; No.of diodes:2
OK1-OK3 = EEZ_Lib1:TLP291: Toshiba Photocopler GaAs IRED & Photo-transistor
P1 = EEZ_Lib1:TPOT
Q1 = transistor:*-NPN-: NPN Transistror BF959 corrected 2008.03.06
Q2 Q3 Q5 Q6 = EEZ_Lib1:IRFP240: N-channel MOSFET (TO-247)
Q4 = EEZ_Lib1:NYC0102BLT1G: Surface Mount Thyristor, High dv/dt, 200V
Q7 Q8 = EEZ_Lib1:N-MOSFET
R1-R94 = rcl:R-EU_: RESISTOR, European symbol
SAR1 SAR2 = EEZ_Lib1:SAR: EPCOS surge arrester EF470X Farnell: 1886596
SH1-SH4 = EEZ_Lib1:SHORT
TP1 = EEZ_Lib1:PCB_TEST_TAB
TP2 TP6 = EEZ_Lib1:JUMPER-2PIN
TP3 TP4 = EEZ_connectors:TEST-PIN: Test pin
TP5 = EEZ_connectors:TEST_POINT: Test point for oscilloscope probe
TR1 = EEZ_inductors_and_transformers:FERYSTER_5851: Feryster custom for QR Flyback with VIPer35 (AUX, 6+7V, 12+12V)
TR2 = EEZ_inductors_and_transformers:MURATA_5300: 10A Current sensing transformers
TR3 = EEZ_inductors_and_transformers:PCB_TRAFO_FLYBACK2: PCB flyback transformer, dual secondary, no AUX
X1 = EEZ_connectors:MINIFIT_6659-3: MOLEX 39303035 Wire-To-Board Connector, Single In Line, Mini-Fit Jr 5569 Series, 3 Contacts, Plug, 4.2 mm
X2 = EEZ_connectors:SPOX_22-05-7095: Molex socket; wire-board; male; SPOX; 2.5mm; PIN:9; THT; 3A; tinned; 250V
X3 = EEZ_Lib1:B2B-ZR: JST Socket; wire-board; male; ZH; 1.5mm; PIN:2; THT; 50V; 1A
X4 = EEZ_connectors:MINIFIT_39301020: Molex Socket; wire-board; male; Mini-Fit Jr; 4.2mm; PIN:2; THT; PCB snap
ZD1-ZD5 = EEZ_Lib1:ZENER-DIODE
ZD6 = EEZ_Lib1:PSMAXX: Transient Voltage Suppressor, TVS, P4SMA Series, Unidirectional

## Net classes
0 default: width 0.203 mm, drill 0.4 mm, clearance 0.203 mm
2 gnd: width 0.254 mm, drill 0.4 mm, clearance 0.152 mm to class 0, clearance 0.152 mm to class 1, clearance 0.152 mm